# EAGLE design breakout (EAGLE 8.2.2)
Bosch BNO055 breakout board A breakout board for the Bosch BNO055 9-DOF inertial measurement unit. The BNO055 can be configured to use either I2C or UART by setting the SV1 jumper appropriately. The I2C address can be configured through the SV2 jumper. The debug interface of the BNO055 is exposed through the SV3 pins and can be accessed with an ATMEL ICE or similar debugger.
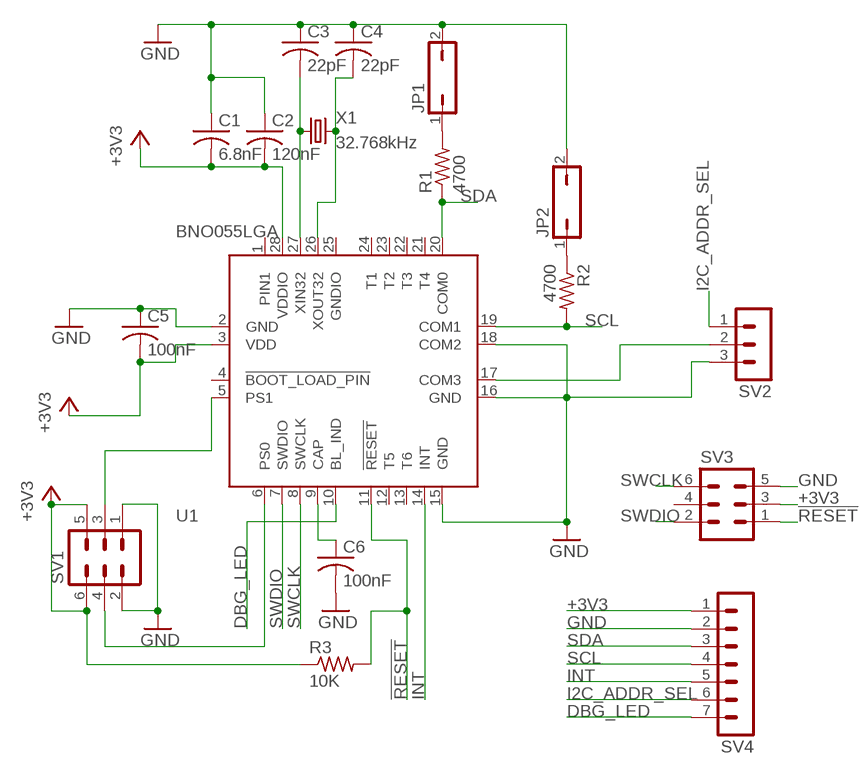
[diagram p0: schematic, sheet 1]

## Parts
C1  6.8nF  C-USC0805  [C0805]
C2  120nF  C-USC0805  [C0805]
C3  22pF  C-USC0805  [C0805]
C4  22pF  C-USC0805  [C0805]
C5  100nF  C-USC0805  [C0805]
C6  100nF  C-USC0805  [C0805]
JP1  JP1Q  [JP1]
JP2  JP1Q  [JP1]
R1  4700  R-US_R0805  [R0805]
R2  4700  R-US_R0805  [R0805]
R3  10K  R-US_R0805  [R0805]
SV1  MA03-2  [MA03-2]
SV2  MA03-1  [MA03-1]
SV3  MA03-2  [MA03-2]
SV4  MA07-1  [MA07-1]
U1  BNO055LGA  [LGA28_BOSCH]
X1  32.768kHz  CRYSTALS-NOGND-WATCH-3X8  [WATCH-3X8]

## Nets
!RESET: R3.2 SV3.1 U1.11(!RESET)
+3V3: C1.2 C2.2 C5.2 R3.1 SV1.5 SV1.6 SV3.3 SV4.1 U1.3(VDD) U1.28(VDDIO)
DBG_LED: SV4.7 U1.10(BL_IND)
GND: C1.1 C2.1 C3.1 C4.1 C5.1 C6.2 JP1.2 JP2.2 SV1.1 SV1.2 SV2.3 SV3.5 SV4.2 U1.2(GND) U1.15(GND) U1.16(GND) U1.18(COM2)
I2C_ADDR_SEL: SV2.1 SV4.6
INT: SV4.5 U1.14(INT)
N$1: C3.2 U1.27(XIN32) X1.1
N$2: C4.2 U1.26(XOUT32) X1.2
N$3: JP1.1 R1.2
N$4: JP2.1 R2.1
N$5: SV2.2 U1.17(COM3)
N$6: C6.1 U1.9(CAP)
N$7: SV1.3 U1.5(PS1)
N$8: SV1.4 U1.6(PS0)
SCL: R2.2 SV4.4 U1.19(COM1)
SDA: R1.1 SV4.3 U1.20(COM0)
SWCLK: SV3.6 U1.8(SWCLK)
SWDIO: SV3.2 U1.7(SWDIO)
Unconnected: SV3.4 U1.1(PIN1) U1.4(!BOOT_LOAD_PIN) U1.12(T5) U1.13(T6) U1.21(T4) U1.22(T3) U1.23(T2) U1.24(T1)

## Power pins joined to a net without a drawn wire
GNDIO: U1.25(GNDIO)

## Library data of the parts
C1-C6 = rcl:C-US: CAPACITOR, American symbol
JP1 JP2 = jumper:JP1Q: JUMPER
R1-R3 = rcl:R-US_: RESISTOR, American symbol
SV1 SV3 = con-lstb:MA03-2: PIN HEADER; OC_FARNELL: unknown; OC_NEWARK: unknown
SV2 = con-lstb:MA03-1: PIN HEADER; OC_FARNELL: unknown; OC_NEWARK: unknown
SV4 = con-lstb:MA07-1: PIN HEADER; OC_FARNELL: unknown; OC_NEWARK: unknown
U1 = m10k:BNO055: Bosch BNO055 9-DOF Inertial Measurement Unit
X1 = IQD-Frequency-Products:CRYSTALS-NOGND: CRYSTALS CAN NOT GROUNDED

## Board
Bosch BNO055 breakout board A breakout board for the Bosch BNO055 9-DOF inertial measurement unit. The BNO055 can be configured to use either I2C or UART by setting the SV1 jumper appropriately. The I2C address can be configured through the SV2 jumper. The debug interface of the BNO055 is exposed through the SV3 pins and can be accessed with an ATMEL ICE or similar debugger.
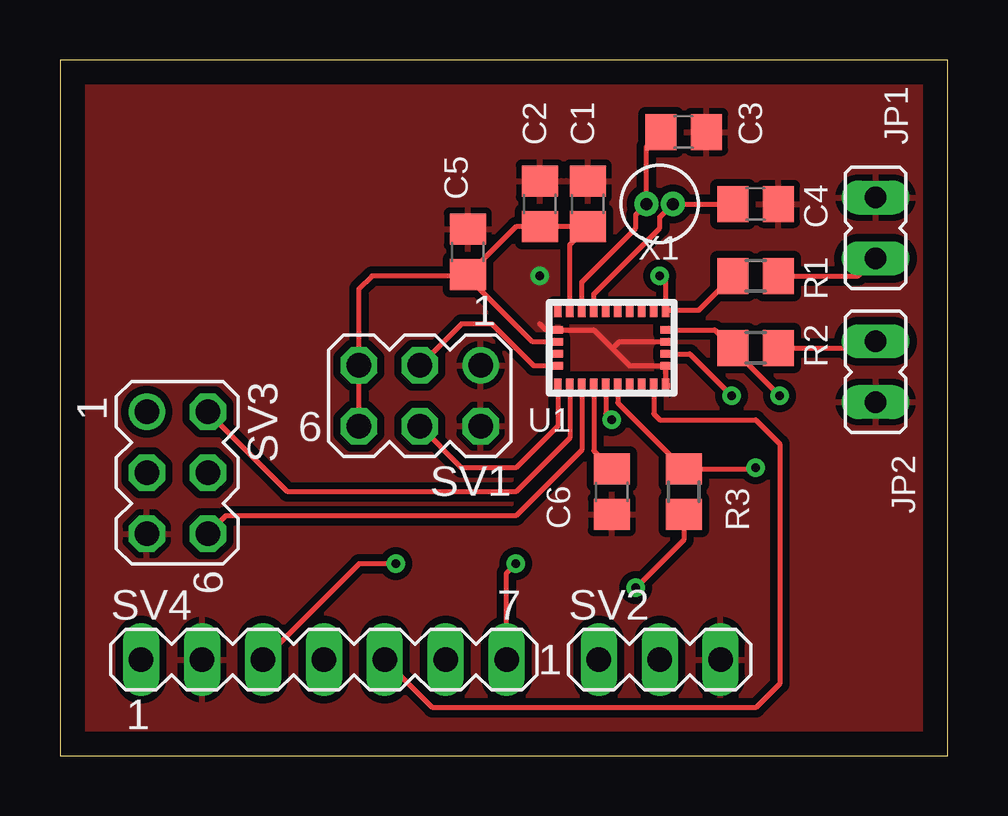
[diagram p1: board, top side]
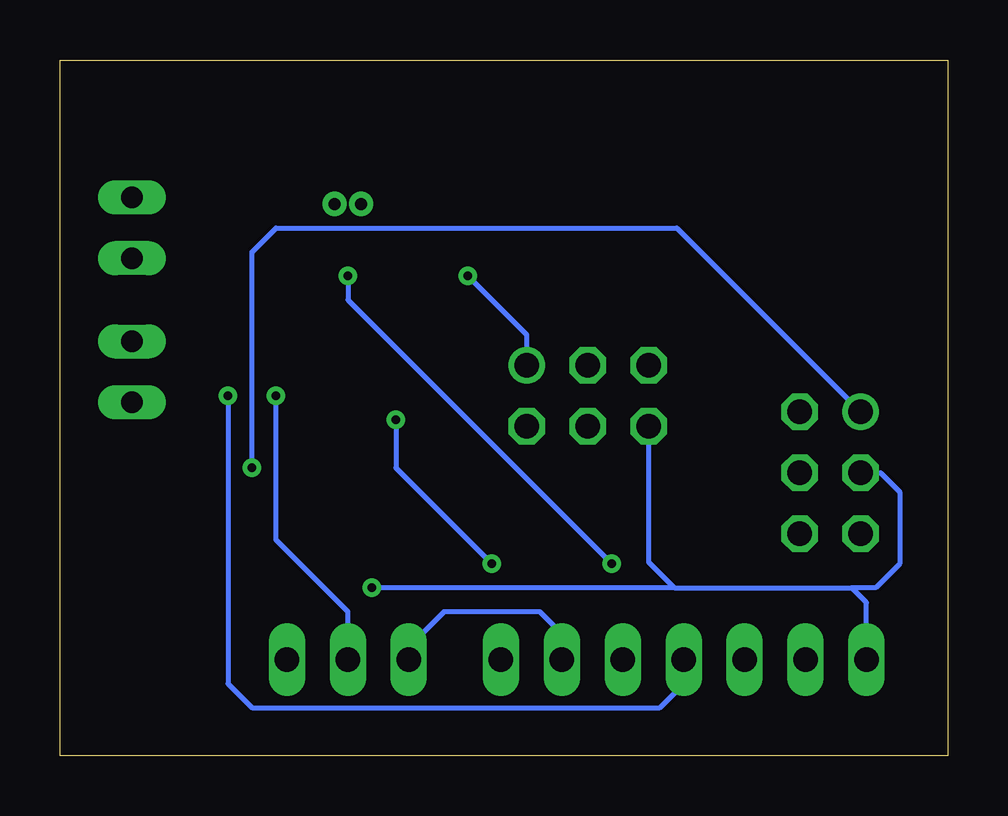
[diagram p2: board, bottom side, seen from below]

Size 37 x 29 mm. Coordinates in mm from the lower left corner, seen from the top.
Outline: 0,0 37,0 37,29 0,29 0,0
Copper layers (1*16): Top 0.035mm / dielectric 1.5mm / Bottom 0.035mm
Design rules "default": minimum track width 6mil, minimum drill 0.35mm, track to track 6mil, track to pad 6mil, pad to pad 6mil, via to via 6mil, smd to smd 6mil, copper to edge 40mil, drill to drill 6mil, minimum pad ring 10mil, minimum via ring 8mil, stop-mask expansion 4mil, vias tented up to drill 0mil, thermal gap 10mil

### Footprints (pad centres in the part's own frame; a part is rotated, then mirrored left to right if it is on the bottom)
C0805 = smd 1.3 x 1.5: 1 -0.95,0; 2 0.95,0
JP1 = drill 0.914 long: 1 0,-1.27; 2 0,1.27
R0805 = smd 1.3 x 1.5: 1 -0.95,0; 2 0.95,0
MA03-2 = drill 1.016: 1 -2.54,-1.27 | drill 1.016 octagon: 2 -2.54,1.27; 3 0,-1.27; 4 0,1.27; 5 2.54,-1.27; 6 2.54,1.27
MA03-1 = drill 1.016 long: 1 -2.54,0; 2 0,0; 3 2.54,0
MA07-1 = drill 1.016 long: 1 -7.62,0; 2 -5.08,0; 3 -2.54,0; 4 0,0; 5 2.54,0; 6 5.08,0; 7 7.62,0
LGA28_BOSCH = smd 0.3 x 0.55: 1 -2.25,1.562; 6 -2.25,-1.562; 7 -1.75,-1.562; 8 -1.25,-1.562; 9 -0.75,-1.562; 10 -0.25,-1.562; 11 0.25,-1.562; 12 0.75,-1.562; 13 1.25,-1.562; 14 1.75,-1.562; 15 2.25,-1.562; 20 2.25,1.562; 21 1.75,1.562; 22 1.25,1.562; 23 0.75,1.562; 24 0.25,1.562; 25 -0.25,1.562; 26 -0.75,1.562; 27 -1.25,1.562; 28 -1.75,1.562 | smd 0.45 x 0.3: 2 -2.25,0.75; 3 -2.25,0.25; 4 -2.25,-0.25; 5 -2.25,-0.75; 16 2.25,-0.75; 17 2.25,-0.25; 18 2.25,0.25; 19 2.25,0.75
WATCH-3X8 = drill 0.5 pad 0.9: 1 -0.55,0; 2 0.55,0

### Placement (x,y rotation side)
C1  22,23 270 top
C2  20,23 270 top
C3  26,26 180 top
C4  29,23 180 top
C5  17,21 270 top
C6  23,11 270 top
JP1  34,22 0 top
JP2  34,16 180 top
R1  29,20 0 top
R2  29,17 180 top
R3  26,11 90 top
SV1  15,15 180 top
SV2  25,4 0 top
SV3  4.89,11.79 270 top
SV4  11,4 0 top
U1  23,17 0 top
X1  25,23 0 top

### Tracks (layer width: path | path; a pad name or v marks a point on that pad's centre or on a via)
!RESET  (via drill 0.35)
  Top 0.2: U1.11 23.25,14.7 R3.2 28.95,11.95 v29,12
  Bottom 0.2: v29,12 29,21 28,22 11.29,22 SV3.1
+3V3  (via drill 0.35)
  Top 0.2: SV1.6 SV1.5 12.46,19.46 13,20 16.95,20 | R3.1 26,9 v24,7 | 16.95,20 C5.2 19,22.05 C2.2 C1.2 21.25,21.3 U1.28 | U1.3 19.7,17.25 16.95,20
  Bottom 0.2: 4,7 3.38,6.38 SV4.1 | 11.39,7 4,7 | 11.39,7 v24,7 | SV3.3 2.79,11.79 2,11 2,8 3,7 4,7 | SV1.6 12.46,8.07 11.39,7
DBG_LED  (via drill 0.35)
  Top 0.2: U1.10 22.75,14.25 v23,14 | SV4.7 18.62,7.62 v19,8
  Bottom 0.2: v23,14 23,12 v19,8
GND  (via drill 0.35)
  Top 0.2: 20,18 20.25,17.75 U1.2 22.25,17.75 23.03,16.97 | U1.15 U1.16 23.75,16.25 23.03,16.97 | U1.18 23.31,17.25 23.03,16.97
  Bottom 0.2: SV1.1 17.54,17.54 v20,20
  pour Top (isolate 0.305): 1,28 1,1 36,1 36,28
I2C_ADDR_SEL
  Bottom 0.2: SV4.6 16.08,5.08 17,6 21,6 22,5 22,4.46 SV2.1
INT
  Top 0.2: U1.14 24.75,14.25 25,14 29,14 30,13 30,3 29,2 15.54,2 SV4.5
N$1
  Top 0.2: U1.27 21.75,19.75 24,22 24,22.55 X1.1 24.45,25.4 C3.2
N$2
  Top 0.2: U1.26 22.25,19.25 25,22 25,22.45 X1.2 C4.2
N$3
  Top 0.2: R1.2 33.27,20 JP1.1
N$4
  Top 0.2: R2.1 33.73,17 JP2.1
N$5  (via drill 0.35)
  Top 0.2: U1.17 26.25,16.75 v28,15
  Bottom 0.2: SV2.2 25,6 28,9 v28,15
N$6
  Top 0.2: U1.9 22.25,12.7 C6.1
N$7
  Top 0.2: U1.5 19.75,16.25 18,18 16.73,18 SV1.3
N$8
  Top 0.2: U1.6 20.75,13.75 19,12 16.73,12 SV1.4
SCL  (via drill 0.35)
  Top 0.2: U1.19 27.3,17.75 R2.2 28.05,16.95 v30,15
  Bottom 0.2: v30,15 30,3 29,2 12,2 11,3 SV4.4
SDA  (via drill 0.35)
  Top 0.2: R1.1 26.61,18.56 U1.20 25.25,19.75 v25,20 | v14,8 12.46,8 SV4.3
  Bottom 0.2: v25,20 25,19 v14,8
SWCLK
  Top 0.2: U1.8 21.75,12.75 19,10 6.91,10 SV3.6
SWDIO
  Top 0.2: U1.7 21.25,13.25 19,11 9.49,11 SV3.2